# Altium schematic sheet Power.SchDoc
size A4; SheetNumber: 3; SheetTotal: 3
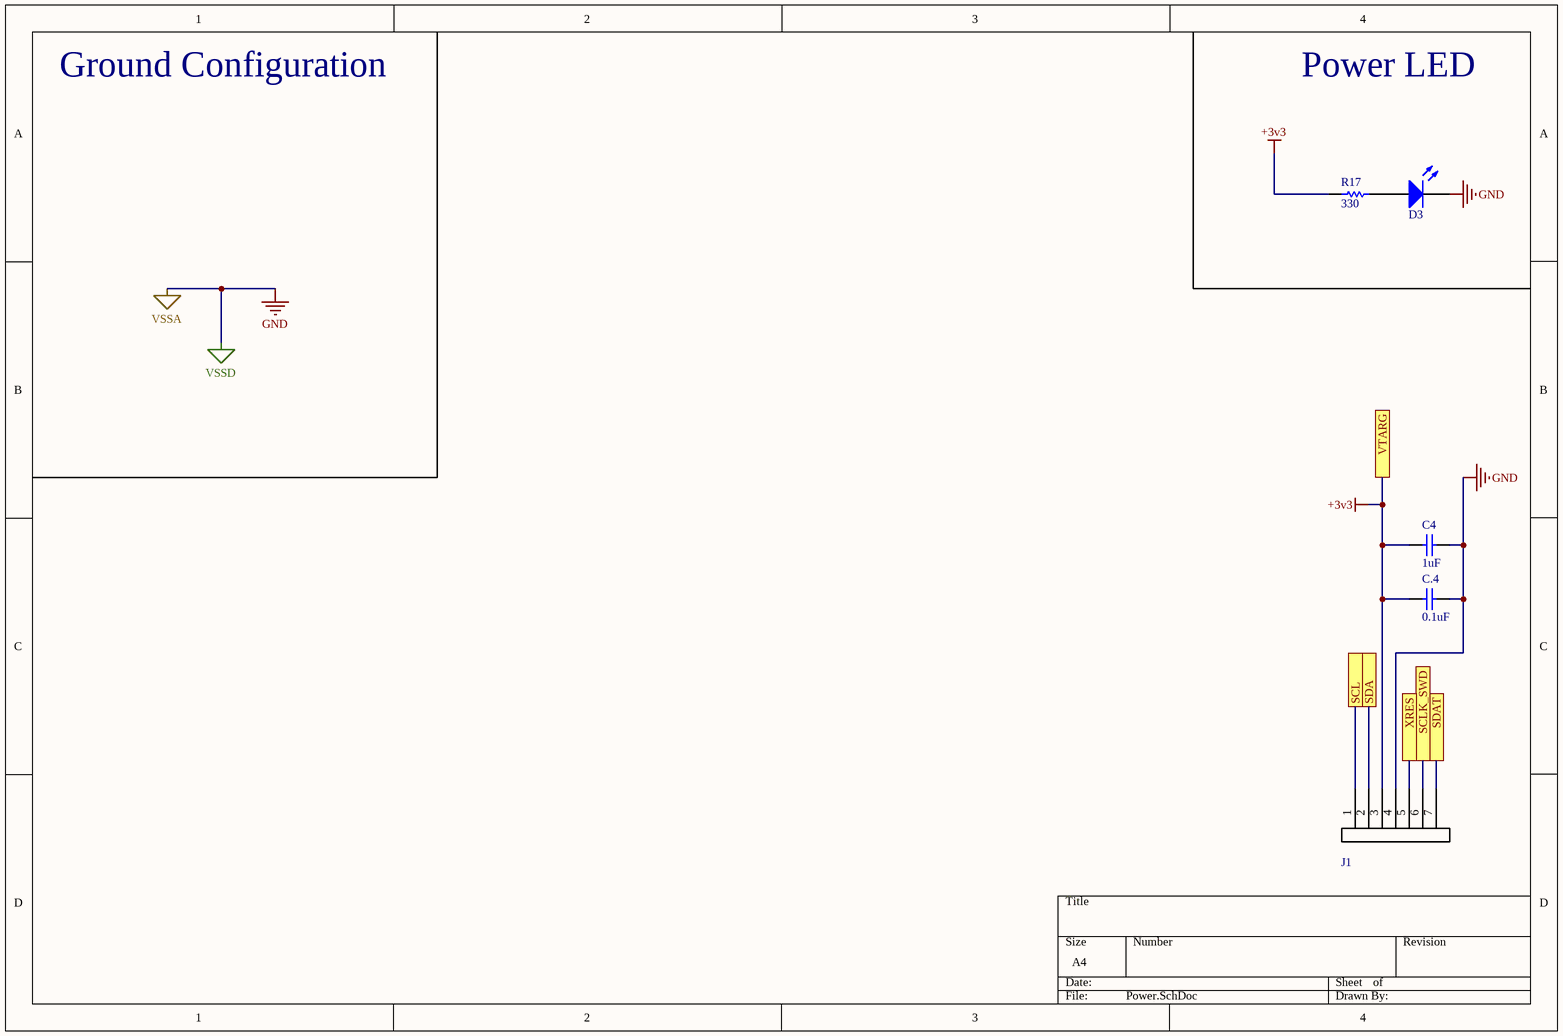
[diagram p0: Power.SchDoc]

## Parts
C4  1uF  [CAPC1005X56X25ML10T15]
C.4  0.1uF  [CAPC1005X56X25ML10T15]
D3  150060BS75000  [0603_A]  (value not drawn)
J1  BM07B-NSHSS-TBT (LF)(SN)  [BM07B-NSHSS-TBT (LF)(SN)]  (value not drawn)
R17  330  [RESC1005X40X25ML05T10]

## Ports
SCL, SCLK_SWD, SDA, SDAT, VTARG, XRES

## Nets
+3v3: C4.1 C.4.1 J1.3 R17.1 ; port VTARG
GND: C4.2 C.4.2 D3.1(K) J1.4  [also labelled VSSA, VSSD]
SCL: J1.1 ; port SCL
SCLK_SWD: J1.6 ; port SCLK_SWD
SDA: J1.2 ; port SDA
SDAT: J1.7 ; port SDAT
XRES: J1.5 ; port XRES
NetD3_2: D3.2(A) R17.2

## Notes on the sheet
- Ground Configuration
- Power LED

## Library data of the parts
C4 C.4 = CMP-1034-02113-2: Manufacturer: AVX Interconnect / Elco; Part Number: 04026D105KAT2A
D3 = CMP-1426-00003-1: SMD mono-color Chip LED, WL-SMCW, Blue; Manufacturer: Wuerth Elektronik; Color: Blue; ComponentLink2Description: Datasheet; ComponentLink2URL: http://katalog.we-online.com/led/datasheet/150060BS75000.pdf; ComponentLink1URL: http://www.we-online.com; PackageReference: 0603_A; PartNumber: 150060BS75000; ComponentLink1Description: Manufacturer URL
R17 = CMP-2002-07972-1: Part Number: RC0402JR-072KL; Manufacturer: Yageo / Phycomp